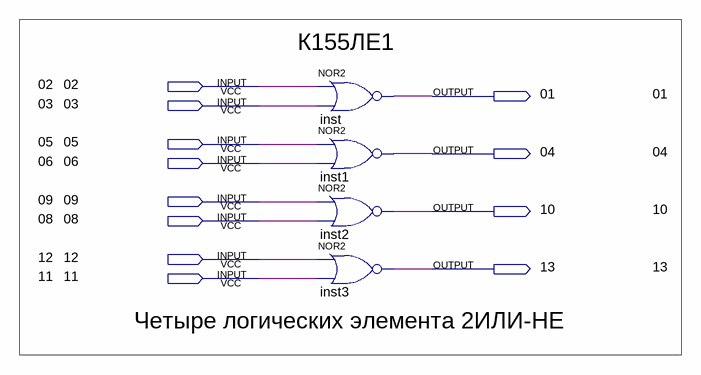
[diagram p0: schematic sheet]
// Quartus schematic K155LE1.bdf as structural Verilog: 4 symbols, 12 pins
module K155LE1 (
  input  \02 ,
  input  \03 ,
  input  \05 ,
  input  \06 ,
  input  \09 ,
  input  \08 ,
  input  \12 ,
  input  \11 ,
  output \01 ,
  output \04 ,
  output \10 ,
  output \13 
);

  nor inst (\01 , \02 , \03 );
  nor inst1 (\04 , \05 , \06 );
  nor inst2 (\10 , \09 , \08 );
  nor inst3 (\13 , \12 , \11 );

  // Notes on the sheet:
  //   К155ЛЕ1
  //   02
  //   01
  //   03
  //   05
  //   04
  //   06
  //   09
  //   10
  //   08
  //   12
  //   13
  //   11
  //   Четыре логических элемента 2ИЛИ-НЕ
endmodule
